# EAGLE design Pi-puck ToF (EAGLE 9.5.1)
CNAME: YRL Pi-puck ToF Sensor Board; CREVISION: v1.0; DESIGNER: J. Hilder / R. Joyce
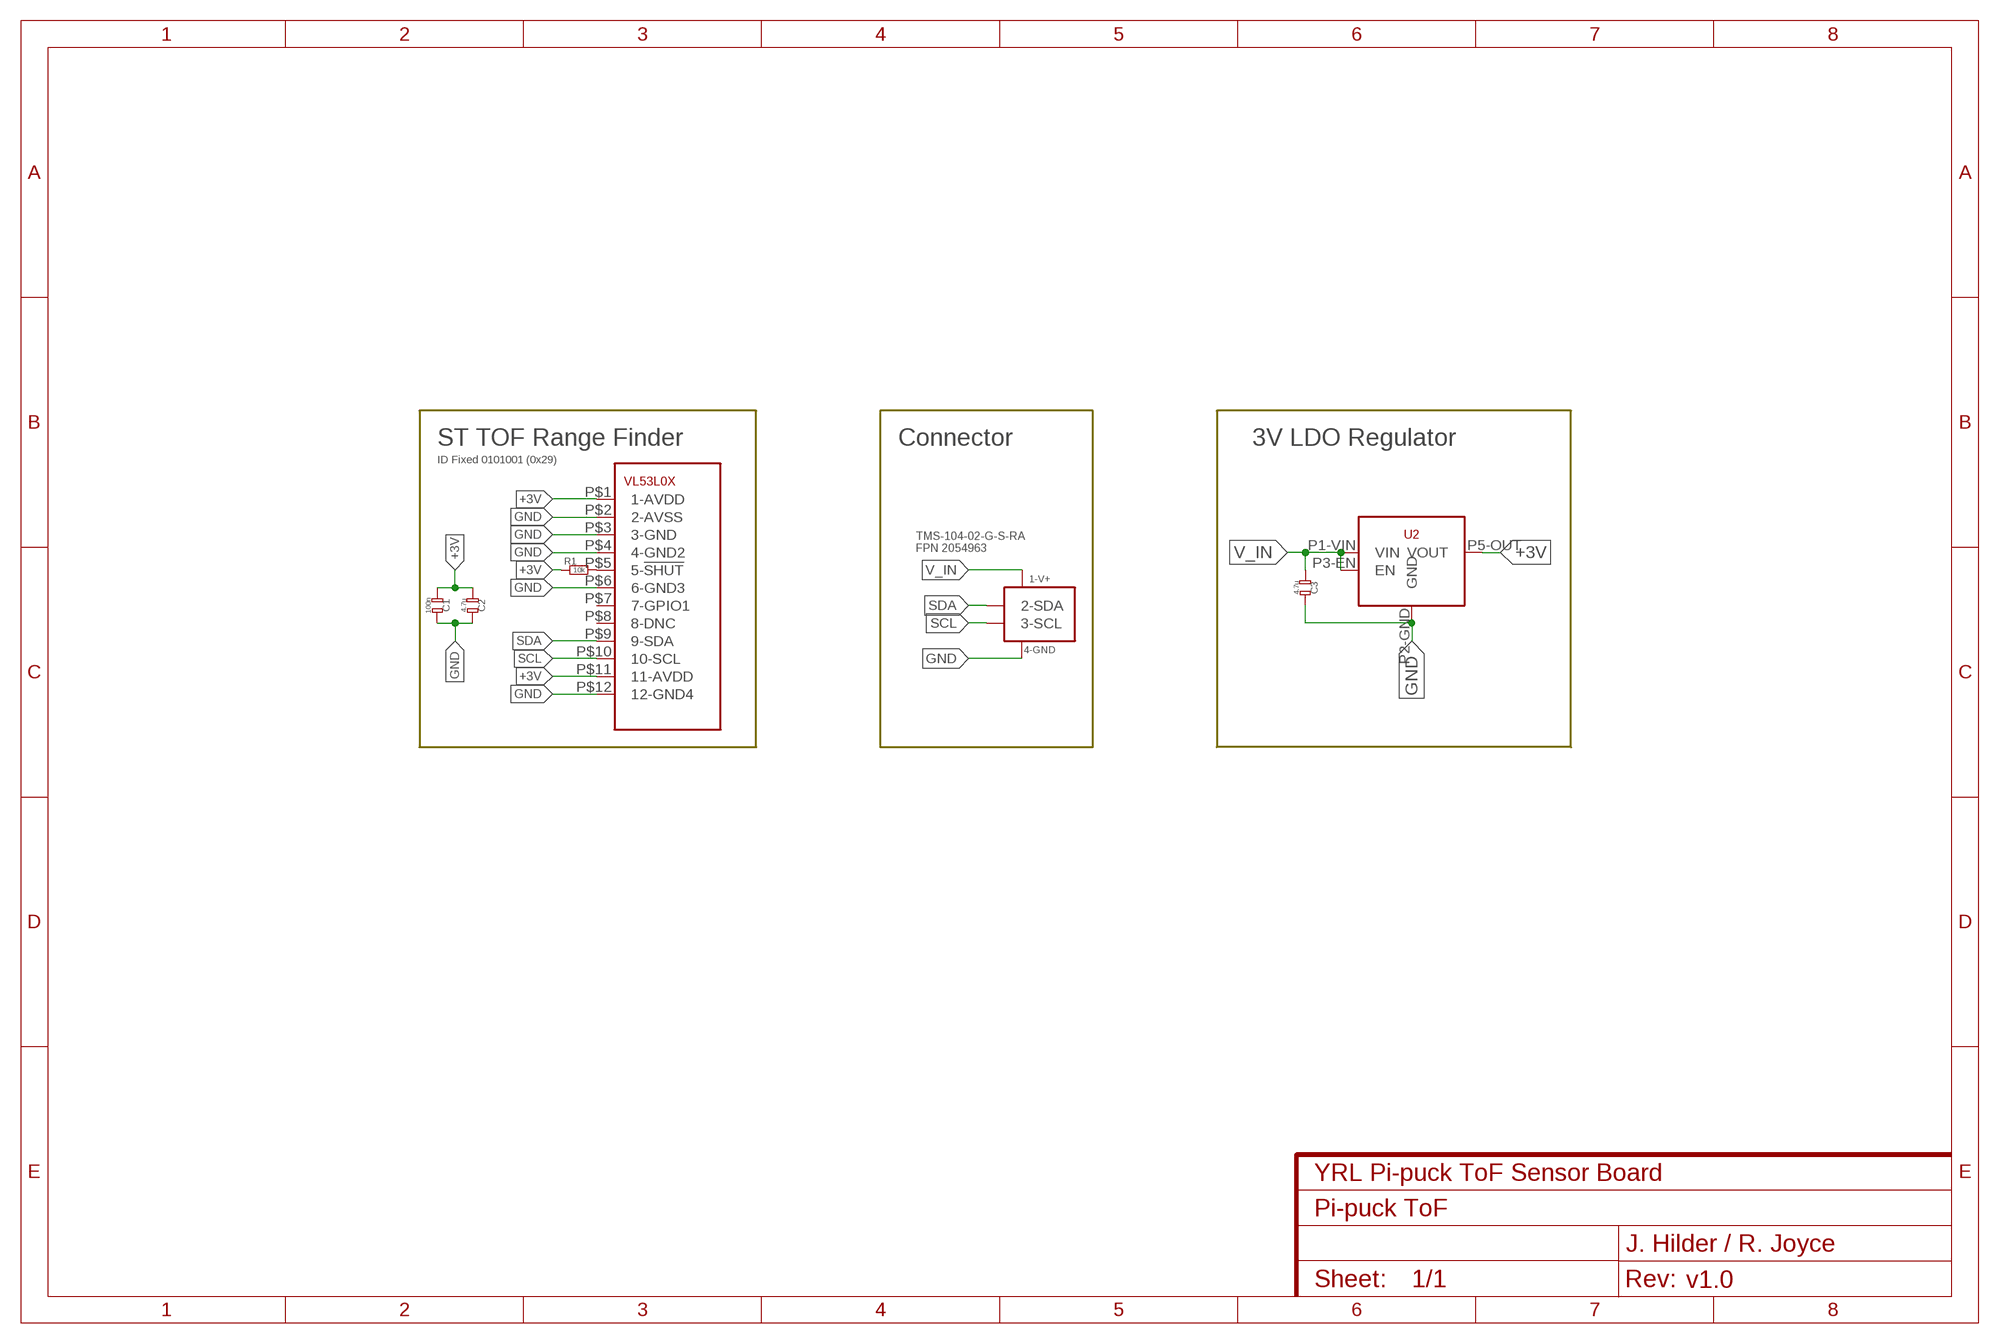
[diagram p0: schematic, sheet 1]

## Parts
C1  100n  CAPACITOR-0603  [0603-RESISTOR]
C2  4.7u  CAPACITOR-0603  [0603-RESISTOR]
C3  4.7u  CAPACITOR-0603  [0603-RESISTOR]
R1  10k  RESISTOR-0603  [0603-RESISTOR]
SC1  4-PIN-SENSOR-2054963-REVERSED  [4-PIN-0.05"-PITCH-THROUGH-HOLE-RA-SENSOR-REVERSED]
U1  ST-VL53L0X  [VL53L0X]
U2  2851575-LIC5365-LDO-3V-SC-70-5  [MIC5365-3.0YC5-TR-SC70-5-LDO-VREG]

## Nets
+3V: C1.1(SD1) C2.1(SD1) R1.1(SD1) U1.P$1(1-AVDD) U1.P$11(11-AVDD) U2.P5-OUT(VOUT)
GND: C1.2(SD2) C2.2(SD2) C3.2(SD2) SC1.1-GND(4-GND) U1.P$2(2-AVSS) U1.P$3(3-GND) U1.P$4(4-GND2) U1.P$6(6-GND3) U1.P$12(12-GND4) U2.P2-GND(GND)
N$17: R1.2(SD2) U1.P$5(5-!SHUT)
SCL: SC1.2-SCL(3-SCL) U1.P$10(10-SCL)
SDA: SC1.3-SDA(2-SDA) U1.P$9(9-SDA)
V_IN: C3.1(SD1) SC1.4-V+(1-V+) U2.P1-VIN(VIN) U2.P3-EN(EN)
Unconnected: U1.P$7(7-GPIO1) U1.P$8(8-DNC)

## Notes on the sheet
- ST TOF Range Finder | Connector | 3V LDO Regulator
- ID Fixed 0101001 (0x29)
- TMS-104-02-G-S-RA
  FPN 2054963

## Library data of the parts
C1-C3 = idea:CAPACITOR-0603
R1 = yrl012-exported:RESISTOR-0603
SC1 = yrl012-exported:4-PIN-SENSOR-2054963-REVERSED
U1 = yrl012-exported:ST-VL53L0X
U2 = SamacSys_Parts:2851575-LIC5365-LDO-3V-SC-70-5

## Board
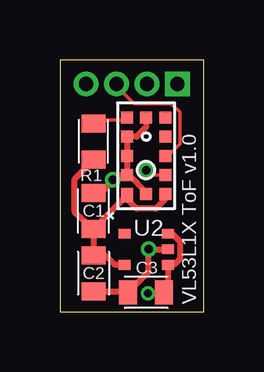
[diagram p1: board, top side]
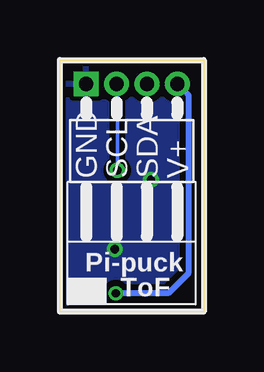
[diagram p2: board, bottom side, seen from below]

Size 6 x 10.5 mm. Coordinates in mm from the lower left corner, seen from the top.
Outline: 0,0 6,0 6,10.5 0,10.5 0,0
Copper layers (1*16): Top 0.018mm / dielectric 1.55mm / Bottom 0.018mm
Design rules "eC_2Layer_PClass6_BaseCopperO18_eCDefault": minimum track width 0.15mm, minimum drill 0.35mm, track to track 0.15mm, track to pad 0.15mm, pad to pad 0.15mm, via to via 0.15mm, smd to smd 0mil, copper to edge 0.25mm, drill to drill 0.35mm, minimum pad ring 0.175mm, minimum via ring 0.125mm, stop-mask expansion 0mil, vias tented up to drill 0.45mm, thermal gap 0.2mm

### Footprints (pad centres in the part's own frame; a part is rotated, then mirrored left to right if it is on the bottom)
0603-RESISTOR = smd 0.75 x 1: 1 -0.75,0; 2 0.75,0
4-PIN-0.05"-PITCH-THROUGH-HOLE-RA-SENSOR-REVERSED = drill 0.6 pad 1.04 square: 1-GND -1.905,0 | drill 0.6 pad 1.04: 2-SCL -0.635,0; 3-SDA 0.635,0; 4-V+ 1.905,0
VL53L0X = smd 0.6 x 0.5: P$1 1.65,-0.8 | smd 0.5 x 0.5: P$2 0.8,-0.8; P$3 0,-0.8; P$4 -0.8,-0.8; P$5 -1.6,-0.8; P$6 -1.6,0; P$7 -1.6,0.8; P$8 -0.8,0.8; P$9 0,0.8; P$10 0.8,0.8; P$11 1.6,0.8; P$12 1.6,0
MIC5365-3.0YC5-TR-SC70-5-LDO-VREG = smd 0.4 x 0.5: P1-VIN 0.65,0.9; P2-GND 0,0.9; P3-EN -0.65,0.9; P4-NC -0.65,-0.9; P5-OUT 0.65,-0.9

### Placement (x,y rotation side)
C1  1.4,4.2 90 top
C2  1.4,1.6 270 top
C3  3.6,0.8 180 top
R1  1.4,7.1 90 top
SC1  3,9.5 0 bottom
U1  3.6,6.5 270 top
U2  3.6,2.6 270 top

### Tracks (layer width: path | path; a pad name or v marks a point on that pad's centre or on a via)
+3V
  Top 0.254: C1.1 C2.1 1.9,2.35 2.3,1.95 U2.P5-OUT | C1.1 0.62,4.13 0.62,5.54 1.23,6.15 R1.1 | C1.1 U1.P$1 2.8,4.7 3.2,4.3 4,4.3 4.4,4.7 U1.P$11
GND  (via drill 0.35 pad 0.65)
  Top 0.15: C3.2 2.83,0.82
  Top 0.254: C2.2 2.8,0.85 2.83,0.82 | C1.2 1.65,4.85 v2.2,5.5 2.4,5.7 U1.P$2 | U1.P$2 U1.P$3 U1.P$4 3.2,7.3 3.6,7.7 U1.P$6 | C3.2 3.7,1.65 v3.7,2.6 U2.P2-GND | U1.P$12 3.6,5 2.9,5.7 U1.P$2
  pour Bottom (isolate 0.254): 0.1,10.4 5.9,10.4 5.9,0.1 0.1,0.1
N$17
  Top 0.15: U1.P$5 2.7,8 1.55,8 R1.2
SCL  (via drill 0.35 pad 0.65)
  Top 0.15: v3.6,5.9 3.8,5.7 U1.P$10
  Bottom 0.15: SC1.2-SCL 3.6,9.46 v3.6,5.9
SDA
  Top 0.15: SC1.3-SDA 2.37,9.41 3.1,8.68 4.64,8.68 5,8.32 5,7 4.5,6.5 U1.P$9
V_IN  (via drill 0.35)
  Top 0.254: v3.67,0.76 3.71,0.8 C3.1 4.5,0.95 U2.P1-VIN 4.75,1.95 5.03,2.23 5.03,2.92 4.69,3.25 U2.P3-EN
  Bottom 0.254: v3.67,0.76 1.48,0.76 0.62,1.62 0.62,9.02 SC1.4-V+

### Text on the board
bPlace: Pi-puck / ToF
tNames: VL53L1X ToF v1.0